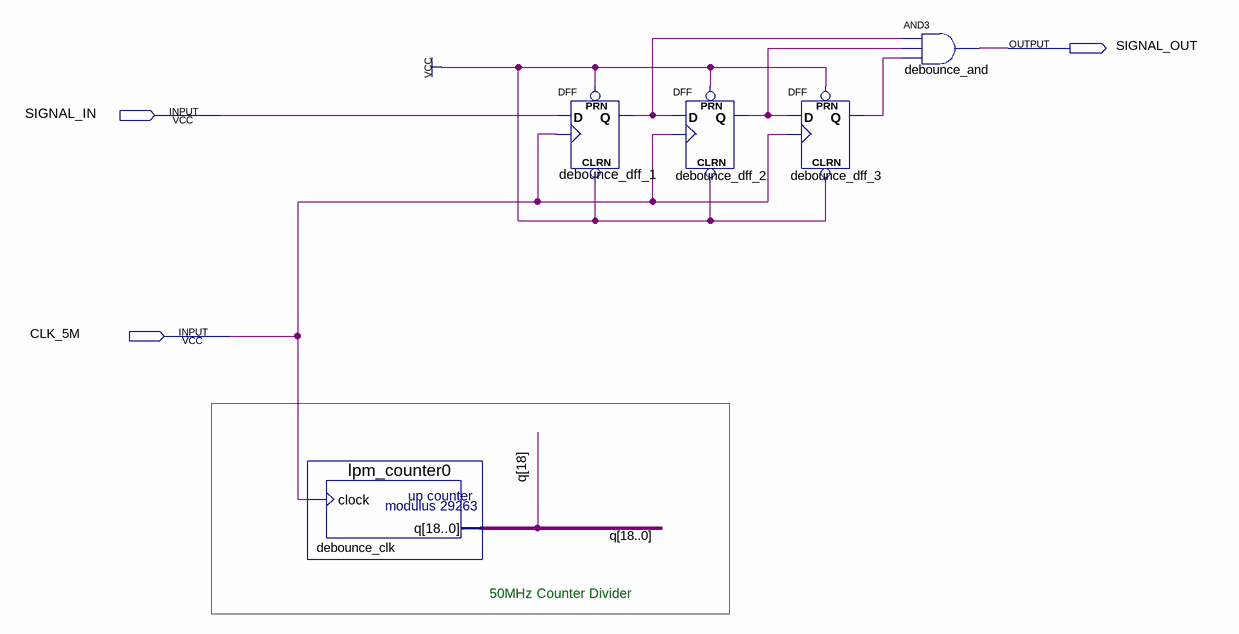
[diagram p0: schematic sheet]
// Quartus schematic debouncer.bdf as structural Verilog: 5 symbols, 3 pins
module debouncer (
  input  SIGNAL_IN,
  input  CLK_5M,
  output SIGNAL_OUT
);

  wire debounce_dff_1_q, debounce_dff_2_q, debounce_dff_3_q;
  wire [18:0] q;

  lpm_counter0 debounce_clk (.clock(CLK_5M), .q(q));
  DFF debounce_dff_1 (.CLRN(1'b1), .CLK(CLK_5M), .D(SIGNAL_IN), .PRN(1'b1), .Q(debounce_dff_1_q));
  DFF debounce_dff_2 (.CLRN(1'b1), .CLK(CLK_5M), .D(debounce_dff_1_q), .PRN(1'b1), .Q(debounce_dff_2_q));
  DFF debounce_dff_3 (.CLRN(1'b1), .CLK(CLK_5M), .D(debounce_dff_2_q), .PRN(1'b1), .Q(debounce_dff_3_q));
  and debounce_and (SIGNAL_OUT, debounce_dff_1_q, debounce_dff_2_q, debounce_dff_3_q);

  // Notes on the sheet:
  //   50MHz Counter Divider
endmodule
